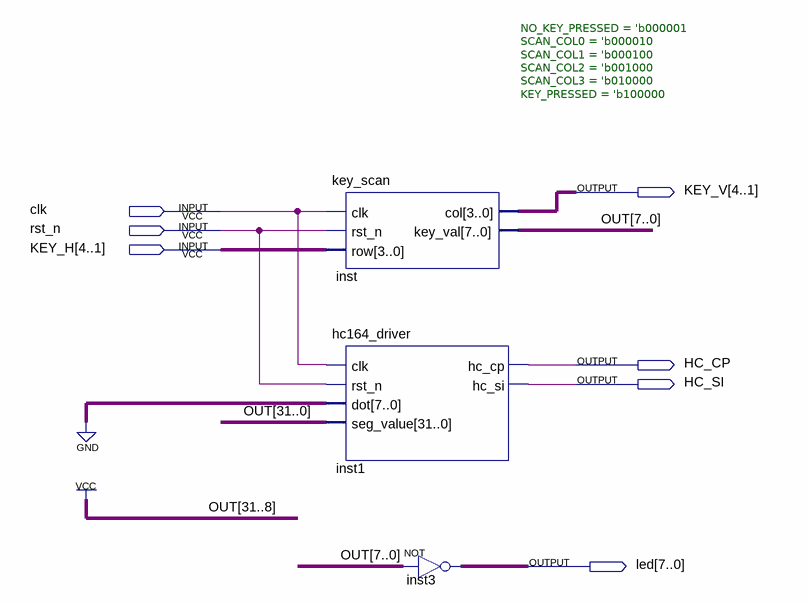
[diagram p0: schematic sheet]
// Quartus schematic key_test(1).bdf as structural Verilog: 3 symbols, 7 pins
module \key_test(1)  (
  input  clk,
  input  rst_n,
  input  [4:1] KEY_H,
  output [4:1] KEY_V,
  output HC_CP,
  output HC_SI,
  output [7:0] led
);

  wire [7:0] OUT;

  key_scan #(.NO_KEY_PRESSED('b000001), .SCAN_COL0('b000010), .SCAN_COL1('b000100), .SCAN_COL2('b001000), .SCAN_COL3('b010000), .KEY_PRESSED('b100000)) inst (
    .clk(clk), .rst_n(rst_n), .row(KEY_H), .col(KEY_V), .key_val(OUT));
  hc164_driver inst1 (
    .clk(clk), .rst_n(rst_n), .dot({8{1'b0}}), .seg_value({{24{1'b1}}, OUT}), .hc_cp(HC_CP), .hc_si(HC_SI));
  assign led = ~OUT;  // NOT inst3, 8 bits wide
endmodule
